# Altium schematic sheet USB.SchDoc
size A4; SheetNumber: 8; SheetTotal: 11
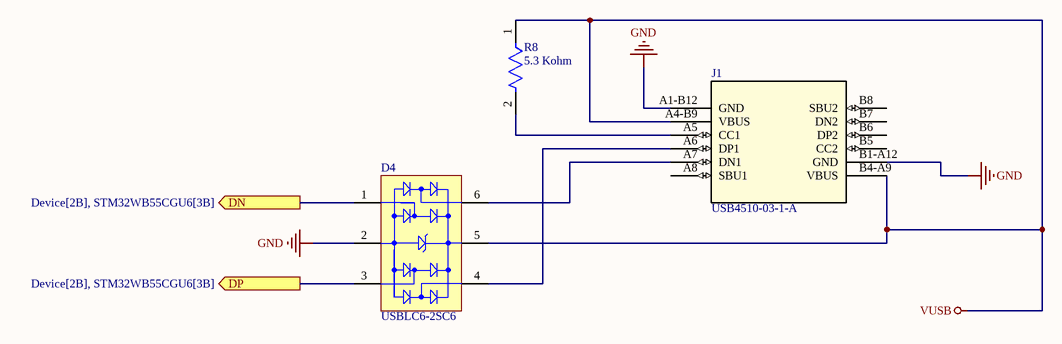
[diagram p0: USB.SchDoc]

## Parts
D4  USBLC6-2SC6  [STM-SOT23-6L_V]
J1  USB4510-03-1-A  [USB4510-03-1-A_GCT]
R8  5.3 Kohm  [FP-RC1005-IPC_C]

## Ports
DN (out, see Device[2B], STM32WB55CGU6[3B]), DP (out, see Device[2B], STM32WB55CGU6[3B])

## Nets
GND: D4.2(GND) J1.A1-B12(GND) J1.B1-A12(GND)
VUSB: D4.5(VBUS) J1.A4-B9(VBUS) J1.B4-A9(VBUS) R8.1
DN: D4.1(I/O_1) ; port DN
DP: D4.3(I/O_2) ; port DP
NetD4_4: D4.4(I/O_3) J1.A6(DP1)
NetD4_6: D4.6(I/O_4) J1.A7(DN1)
NetJ1_A5: J1.A5(CC1) R8.2

Not connected (* = marked no-connect by the designer): J1 A8(SBU1) B5(CC2) B6(DP2) B7(DN2) B8(SBU2)

## Library data of the parts
D4 = CMP-2000-05378-1: Very low capacitance ESD protection, 3.5 pF, -40 to 125 degC, 6-Pin SOT23, RoHS, Tape and Reel; Manufacturer: STMicroelectronics; Polarity: Uni-Directional; Clamping Voltage: 17V; Rad Hardened: No; Product Height (mm): 1.3mm; Leakage Current (Max): 0.15uA; Product Length (mm): 3.05mm; Number of Elements: 1; Peak Pulse Current: 5A; Configuration: Dual; Reverse Breakdown Voltage: 6V; Working Voltage (Max): 5V; Capacitance Value: 3.5pF; Suppressor Type: DiodeArrays; Product Depth (mm): 1.75mm; Test Current (It): 1mA; Package / Case: SOT-23; Operating Temperature Max Deg. C: 125C; Package Description: 6-Pin Small Outline Transistor, Body 2.925 x 1.625 mm, Pitch 0.95 mm; Package Reference: SOT23-6L; Datasheet Version: Rev. 5, 10/2011; Operating Temperature Min Deg. C: -40C; Mounting Style: SurfaceMount; Direction Type: Uni-Directional; Mounting: SurfaceMount; Pin Count: 6; Leakage Current: 0.15uA; Packaging: TapeandReel; Operating Temperature Classification: Automotive; Clamping Voltage (Max): 17V; Manufacturer URL: http://www.st.com/; Reverse Stand-off Voltage: 5V; Datasheet URL: http://www.st.com/st-web-ui/static/active/en/resource/technical/document/datasheet/CD00050750.pdf; Working Voltage: 5V; Operating Temp Range: -40Cto125C
J1 = USB4510-03-1-A: Mfr_Name: Global Connector Technology; Copyright: Copyright (C) 2023 Ultra Librarian. All rights reserved.; Manufacturer_Part_Number: USB4510-03-1-A; RefDes: RefDes; Type: Type
R8 = CMP-13261-000953-1: Res Thick Film 0402 1.87kΩ 1% 0.063W ±100ppm/°C Molded SMD T/R; Power Rating: 63mW; Voltage Rating (DC): 50V; Resistance: 1.87kR; Tolerance: 1%; Height: 0.016inch; Length: 1mm; Case Code (Metric): 1005; Width: 0.02inch; Max Power Dissipation: 63mW; Radiation Hardening: No; Features: Moisture Resistant; Temperature Coefficient: 100ppm/°C; Min Operating Temperature: -55°C; Number of Terminations: 2; Max Operating Temperature: 155°C; Case Code (Imperial): 0402; Composition: Thick Film; Depth: 0.5mm; Lead Free: Lead Free; Package Quantity: 1; Case/Package: 0402; Packaging: Tape and Reel; Contact Plating: Tin; Military Standard: Not